# Altium schematic sheet ui-pcb.SchDoc
size A4; SheetNumber: 1; SheetTotal: 8
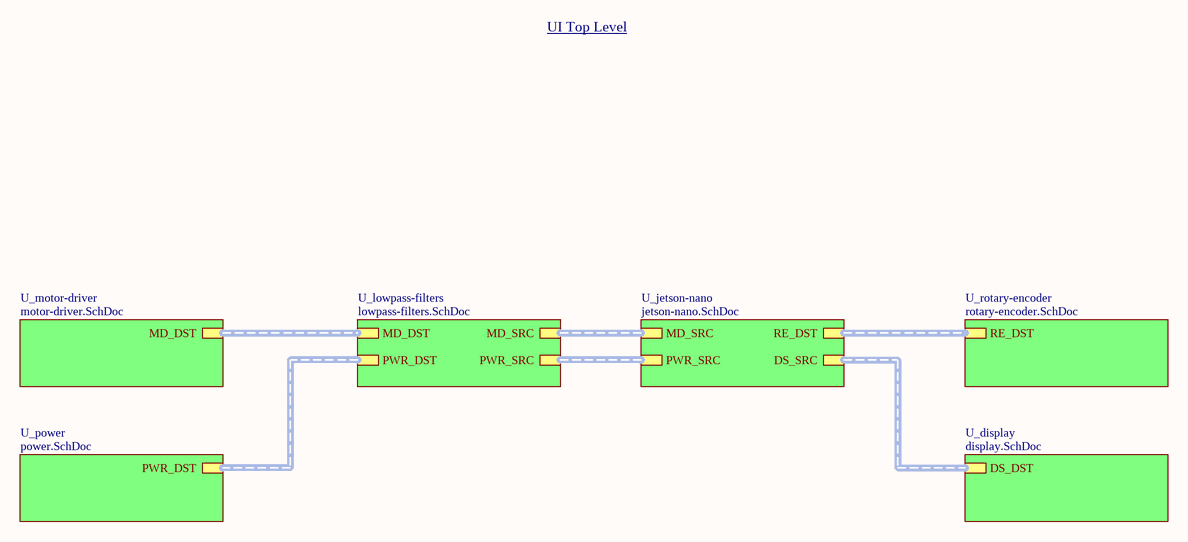
[diagram p0: ui-pcb.SchDoc]

## Sub-sheets
U_display = display.SchDoc: DS_DST (harness DS_SIGNALS)
U_jetson-nano = jetson-nano.SchDoc: DS_SRC (harness DS_SIGNALS), PWR_SRC (harness PWR_SIGNALS), MD_SRC (harness MD_SIGNALS), RE_DST (harness RE_SIGNALS)
U_lowpass-filters = lowpass-filters.SchDoc: PWR_SRC (harness PWR_SIGNALS), PWR_DST (harness PWR_SIGNALS), MD_SRC (harness MD_SIGNALS), MD_DST (harness MD_SIGNALS)
U_motor-driver = motor-driver.SchDoc: MD_DST (harness MD_SIGNALS)
U_power = power.SchDoc: PWR_DST (harness PWR_SIGNALS)
U_rotary-encoder = rotary-encoder.SchDoc: RE_DST (harness RE_SIGNALS)

## Buses and harness runs
harness sheet U_display/DS_DST = sheet U_jetson-nano/DS_SRC
harness sheet U_jetson-nano/MD_SRC = sheet U_lowpass-filters/MD_SRC
harness sheet U_jetson-nano/PWR_SRC = sheet U_lowpass-filters/PWR_SRC
harness sheet U_jetson-nano/RE_DST = sheet U_rotary-encoder/RE_DST
harness sheet U_lowpass-filters/MD_DST = sheet U_motor-driver/MD_DST
harness sheet U_lowpass-filters/PWR_DST = sheet U_power/PWR_DST

## Notes on the sheet
- UI Top Level